# EAGLE schematic simpleWiresModule (EAGLE 9.6.2)
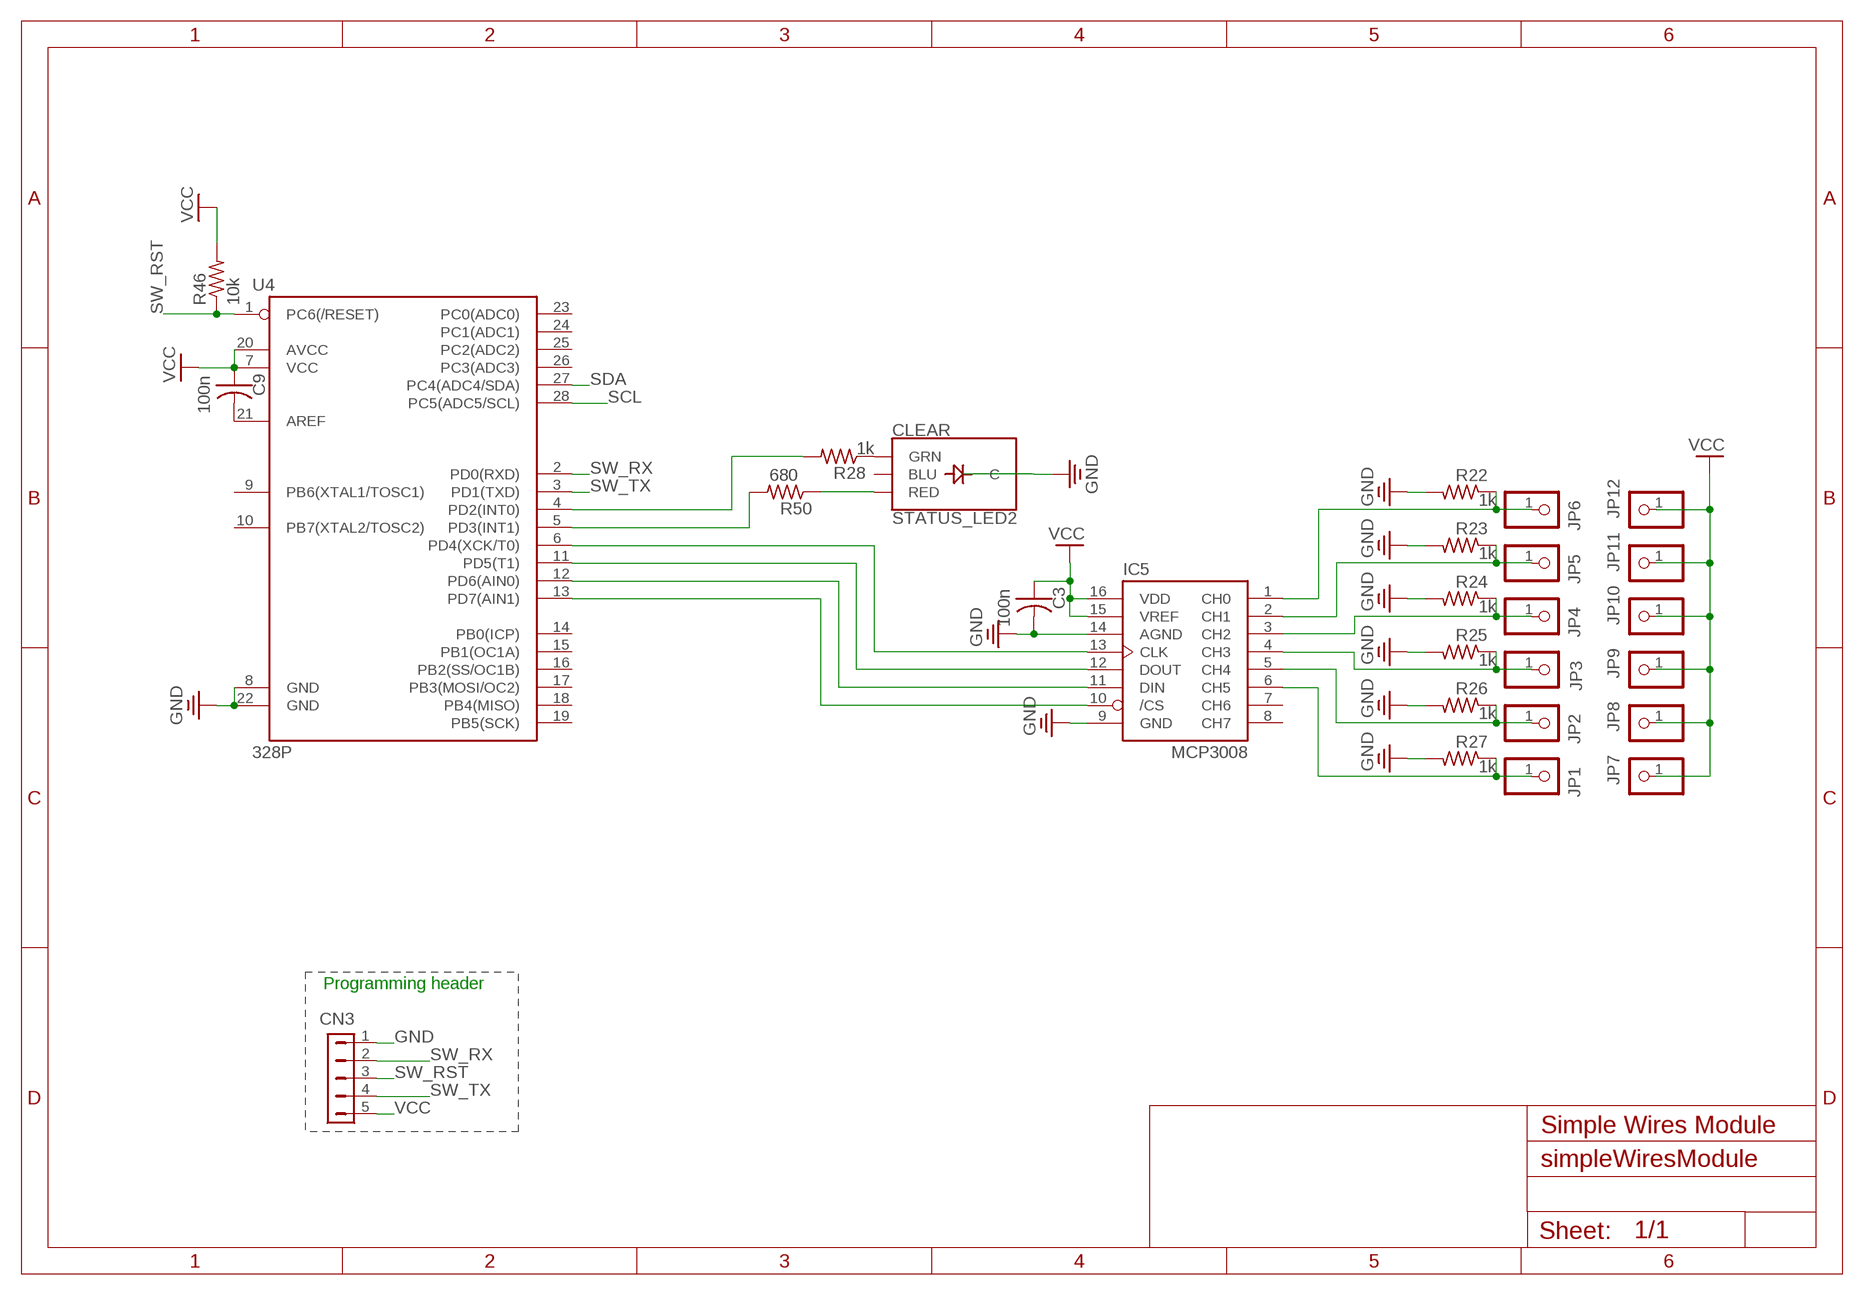
[diagram p0: schematic, sheet 1]

## Parts
C3  100n  C-US025-024X044  [C025-024X044]
C9  100n  C-US025-024X044  [C025-024X044]
CN3  HDR-1X5-SIP-100  [SIP-100-5V]
IC5  MCP3008  [DIL16]
JP1  PINHD-1X1  [1X01]
JP2  PINHD-1X1  [1X01]
JP3  PINHD-1X1  [1X01]
JP4  PINHD-1X1  [1X01]
JP5  PINHD-1X1  [1X01]
JP6  PINHD-1X1  [1X01]
JP7  PINHD-1X1  [1X01]
JP8  PINHD-1X1  [1X01]
JP9  PINHD-1X1  [1X01]
JP10  PINHD-1X1  [1X01]
JP11  PINHD-1X1  [1X01]
JP12  PINHD-1X1  [1X01]
R22  1k  FLIPFLOP-RES  [0805-THM]
R23  1k  FLIPFLOP-RES  [0805-THM]
R24  1k  FLIPFLOP-RES  [0805-THM]
R25  1k  FLIPFLOP-RES  [0805-THM]
R26  1k  FLIPFLOP-RES  [0805-THM]
R27  1k  FLIPFLOP-RES  [0805-THM]
R28  1k  FLIPFLOP-RES  [0805-THM]
R46  10k  R-US_0309/12  [0309/12]
R50  680  FLIPFLOP-RES  [0805-THM]
STATUS_LED2  CLEAR  LED-RGB-CCCLEAR  [LED-RGB-THRU]
U4  328P  ATMEGA328P_PDIP  [DIP28]

## Nets
GND: C3.2 CN3.1 IC5.9(GND) IC5.14(AGND) R22.2 R23.2 R24.2 R25.2 R26.2 R27.2 U4.8(GND) U4.22(GND)
N$16: R28.1 STATUS_LED2.3(GRN)
N$20: IC5.1(CH0) JP6.1 R22.1
N$21: STATUS_LED2.2(C) ; supply symbol labelled GND
N$27: IC5.6(CH5) JP1.1 R27.1
N$32: R50.1 STATUS_LED2.1(RED)
N$37: IC5.5(CH4) JP2.1 R26.1
N$51: IC5.4(CH3) JP3.1 R25.1
N$66: IC5.3(CH2) JP4.1 R24.1
N$74: IC5.2(CH1) JP5.1 R23.1
N$75: R28.2 U4.4(PD2(INT0))
N$76: R50.2 U4.5(PD3(INT1))
N$86: IC5.13(CLK) U4.6(PD4(XCK/T0))
N$87: IC5.12(DOUT) U4.11(PD5(T1))
N$88: IC5.11(DIN) U4.12(PD6(AIN0))
N$90: IC5.10(/CS) U4.13(PD7(AIN1))
N$124: C9.2 U4.21(AREF)
SCL: U4.28(PC5(ADC5/SCL))
SDA: U4.27(PC4(ADC4/SDA))
SW_RST: CN3.3 R46.1 U4.1(PC6(/RESET))
SW_RX: CN3.2 U4.2(PD0(RXD))
SW_TX: CN3.4 U4.3(PD1(TXD))
VCC: C3.1 C9.1 CN3.5 IC5.15(VREF) IC5.16(VDD) JP7.1 JP8.1 JP9.1 JP10.1 JP11.1 JP12.1 R46.2 U4.7(VCC) U4.20(AVCC)
Unconnected: IC5.7(CH6) IC5.8(CH7) STATUS_LED2.4(BLU) U4.9(PB6(XTAL1/TOSC1)) U4.10(PB7(XTAL2/TOSC2)) U4.14(PB0(ICP)) U4.15(PB1(OC1A)) U4.16(PB2(SS/OC1B)) U4.17(PB3(MOSI/OC2)) U4.18(PB4(MISO)) U4.19(PB5(SCK)) U4.23(PC0(ADC0)) U4.24(PC1(ADC1)) U4.25(PC2(ADC2)) U4.26(PC3(ADC3))

## Notes on the sheet
- Programming header
- Simple Wires Module

## Library data of the parts
C3 C9 = adafruit:C-US: CAPACITOR, American symbol
CN3 = con-hdrs40:HDR-1X5: HEADER CONNECTOR
IC5 = adafruit:MCP3008
JP1-JP12 = adafruit:PINHD-1X1: Pin header 1x1 for 0.1" spacing With round pins
R22-R28 R50 = adafruit:FLIPFLOP-RES: Flip Flop resistor An 0805 resistor inside a standard 1/4W 5% resistor. Makes for easy mods
R46 = adafruit:R-US_: RESISTOR, American symbol
STATUS_LED2 = SparkFun-LED:LED-RGB-CC: LED-RGB Common Cathode Packages: LED RGB-THRU LED_PIRANHA_5MM SparkFun Products: RGB Diffused Common Cathode- Diffuse <[https://www.sparkfun.com/products/9264]> RGB Diffused Common Cathode - Clear <[https://www.sparkfun.com/products/105]> LED-RGB 5mm Square (Piranha) <[https://www.sparkfun.com/products/11679]>; PROD_ID: DIO-08418
U4 = SparkFun-IC-Microcontroller:ATMEGA328P_PDIP: Atmel 328P Through hole ATMEGA328P uC used in the Arduino 32kb flash, 1k EEPROM, 2k SRAM Datasheet <http://www.sparkfun.com/datasheets/Components/SMD/ATMega328.pdf> SparkFun Products Storefront component: AVR 28 Pin 20MHz 32K 6A/D - ATMega328P <https://www.sparkfun.com/products/9061> (COM-09061) SparkFun Simon Says - Through-Hole Soldering Kit <https://www.sparkfun.com/products/10547> (KIT-10547) SparkFun Learn to Solder - Simon Says <https://www.sparkfun.com/products/13708> (KIT-13708) SparkFun BigTime Watch Kit <https://www.sparkfun.com/products/11734> (KIT-11734) SparkFun ClockIt <https://www.sparkfun.com/products/10930> (KIT-10930) SparkFun Serial Enabled LCD Kit <https://www.sparkfun.com/products/10097> (LCD-10097) SparkFun Simon Tilts - Through Hole Soldering Kit <https://www.sparkfun.com/products/12634> (KIT-12634) SparkFun Frequency Counter Kit <https://www.sparkfun.com/products/10140> (KIT-10140) FabFM Radio Kit <https://www.sparkfun.com/products/11043> (KIT-11043) SparkFun Binary Blaster Kit <https://www.sparkfun.com/products/12037> (KIT-12037) SparkFun Metro-Gnome <https://www.sparkfun.com/products/9236> (KIT-09236) ATmega328 with Arduino Optiboot (Uno) <https://www.sparkfun.com/products/10524> (DEV-10524); PROD_ID: IC-09136